# EAGLE design electronicload (EAGLE 6.5.0)
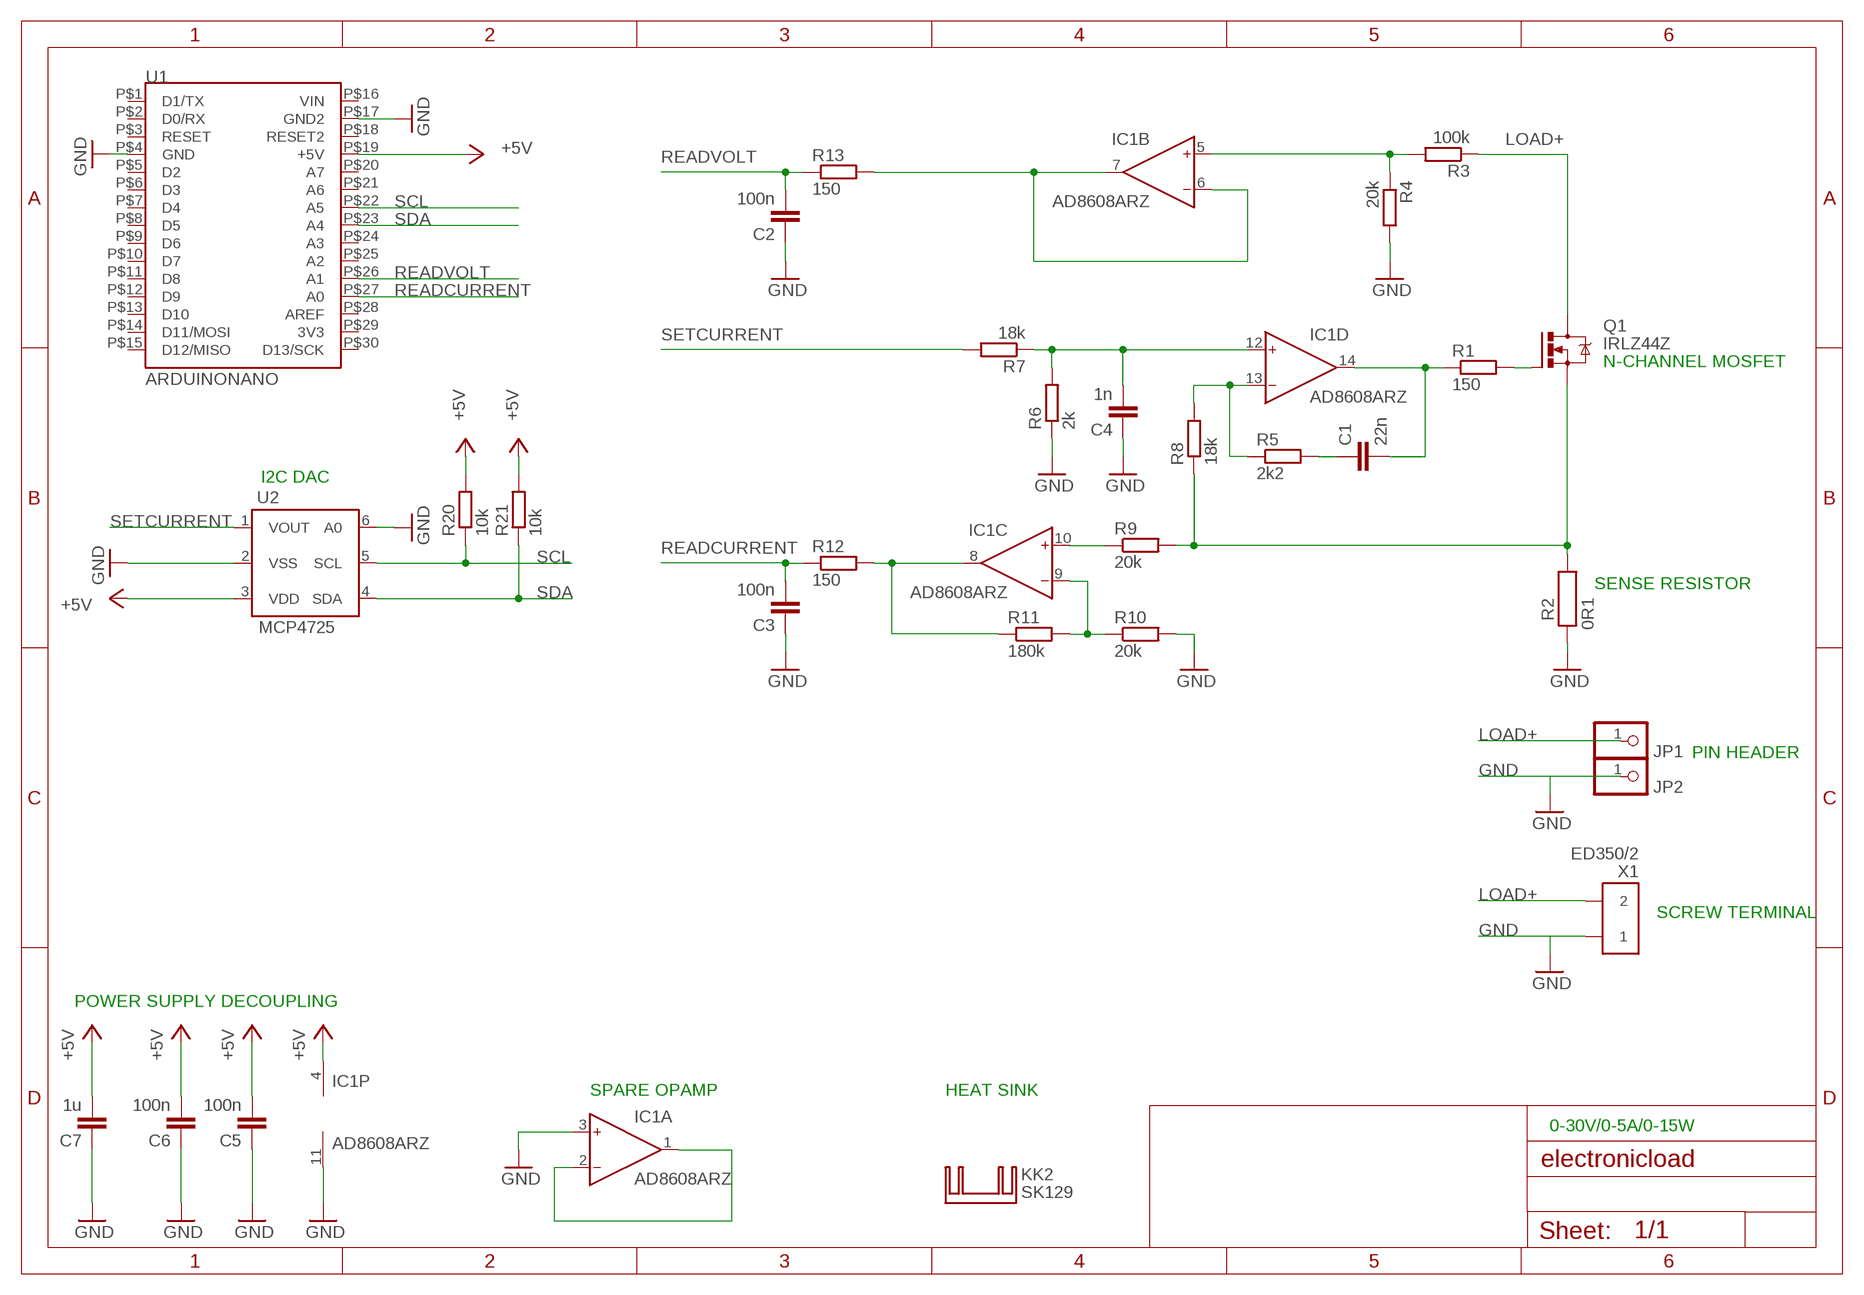
[diagram p0: schematic, sheet 1]

## Parts
C1  22n  C-EUC0603K  [C0603K]
C2  100n  C-EUC0603K  [C0603K]
C3  100n  C-EUC0603K  [C0603K]
C4  1n  C-EUC0603K  [C0603K]
C5  100n  C-EUC0603K  [C0603K]
C6  100n  C-EUC0603K  [C0603K]
C7  1u  C-EUC0603K  [C0603K]
IC1  AD8608ARZ  AD8608R  [SO14]
JP1  PINHD-1X1  [1X01]
JP2  PINHD-1X1  [1X01]
KK2  SK129  [SK129-HOLE]
Q1  IRLZ44Z  [TO220BV]
R1  150  R-EU_R0603  [R0603]
R2  0R1  [S3]
R3  100k  R-EU_R0603  [R0603]
R4  20k  R-EU_R0603  [R0603]
R5  2k2  R-EU_R0603  [R0603]
R6  2k  R-EU_R0603  [R0603]
R7  18k  R-EU_R0603  [R0603]
R8  18k  R-EU_R0603  [R0603]
R9  20k  R-EU_R0603  [R0603]
R10  20k  R-EU_R0603  [R0603]
R11  180k  R-EU_R0603  [R0603]
R12  150  R-EU_R0603  [R0603]
R13  150  R-EU_R0603  [R0603]
R20  10k  R-EU_R0603  [R0603]
R21  10k  R-EU_R0603  [R0603]
U1  ARDUINONANO  [ARDUINONANO]
U2  MCP4725  [SOT-23-6]
X1  ED350/2  [ED350/2]

## Nets
+5V: C5.2 C6.2 C7.2 IC1.4(P:V+) R20.2 R21.2 U1.P$19(+5V) U2.3(VDD)
GATE: Q1.G R1.2
GND: C2.1 C3.1 C4.1 C5.1 C6.1 C7.1 IC1.3(A:IN+) IC1.11(P:V-) JP2.1 R2.1 R4.2 R6.1 R10.2 U1.P$4(GND) U1.P$17(GND2) U2.2(VSS) U2.6(A0) X1.P$1
LOAD+: JP1.1 Q1.D R3.1 X1.P$2
N$1: C1.2 IC1.14(D:OUT) R1.1
N$2: IC1.6(B:IN-) IC1.7(B:OUT) R13.2
N$3: IC1.10(C:IN+) R9.1
N$4: IC1.13(D:IN-) R5.1 R8.2
N$5: IC1.5(B:IN+) R3.2 R4.1
N$6: C4.2 IC1.12(D:IN+) R6.2 R7.1
N$7: IC1.9(C:IN-) R10.1 R11.2
N$9: IC1.8(C:OUT) R11.1 R12.2
N$12: C1.1 R5.2
N$20: IC1.1(A:OUT) IC1.2(A:IN-)
READCURRENT: C3.2 R12.1 U1.P$27(A0)
READVOLT: C2.2 R13.1 U1.P$26(A1)
SCL: R20.1 U1.P$22(A5) U2.5(SCL)
SDA: R21.1 U1.P$23(A4) U2.4(SDA)
SENSE: Q1.S R2.2 R8.1 R9.2
SETCURRENT: R7.2 U2.1(VOUT)
Unconnected: U1.P$1(D1/TX) U1.P$2(D0/RX) U1.P$3(RESET) U1.P$5(D2) U1.P$6(D3) U1.P$7(D4) U1.P$8(D5) U1.P$9(D6) U1.P$10(D7) U1.P$11(D8) U1.P$12(D9) U1.P$13(D10) U1.P$14(D11/MOSI) U1.P$15(D12/MISO) U1.P$16(VIN) U1.P$18(RESET2) U1.P$20(A7) U1.P$21(A6) U1.P$24(A3) U1.P$25(A2) U1.P$28(AREF) U1.P$29(3V3) U1.P$30(D13/SCK)

## Notes on the sheet
- N-CHANNEL MOSFET
- I2C DAC
- SENSE RESISTOR
- PIN HEADER
- SCREW TERMINAL
- POWER SUPPLY DECOUPLING
- SPARE OPAMP | HEAT SINK
- 0-30V/0-5A/0-15W

## Library data of the parts
C1 = rcl:C-EU: CAPACITOR, European symbol; DIGIKEY: 445-12490-1-ND; TEMPCOEFF: X5R; TOLERANCE: 10%; VOLTAGE: 25V
C2 C3 C5 C6 = rcl:C-EU: CAPACITOR, European symbol; DIGIKEY: 445-7456-1-ND; TEMPCOEFF: X5R; TOLERANCE: 10%; VOLTAGE: 50V
C4 = rcl:C-EU: CAPACITOR, European symbol; DIGIKEY: 445-12511-1-ND; TEMPCOEFF: X5R; TOLERANCE: 10%; VOLTAGE: 50V
C7 = rcl:C-EU: CAPACITOR, European symbol; DIGIKEY: 311-1444-1-ND; TEMPCOEFF: X5R; TOLERANCE: 10%; VOLTAGE: 16V
IC1 = electronicload:AD8608: Precision, Low Noise, CMOS, Rail-to-Rail, Input/Output Operational Amplifiers http://www.analog.com/static/imported-files/data_sheets/AD8605_8606_8608.pdf; DIGIKEY: AD8608ARZ-ND
JP1 JP2 = pinhead:PINHD-1X1: PIN HEADER
KK2 = heatsink:SK129: HEATSINK manufacturer Fischer/distributor Buerklin
Q1 = electronicload:IRLZ44Z: N-Channel HEXFET® Power MOSFET Logic Level AUTOMOTIVE MOSFET Source: http://www.irf.com/product-info/datasheets/data/irlz44zpbf.pdf; DIGIKEY: IRLZ44ZPBF-ND
R1 R12 R13 = rcl:R-EU_: RESISTOR, European symbol; DIGIKEY: RMCF0603JT150RCT-ND
R2 = electronicload:0R1: S3-0R1F1 Datasheet http://riedon.com/media/pdf/SSL.pdf; DIGIKEY: 696-1214-1-ND
R3 = rcl:R-EU_: RESISTOR, European symbol; DIGIKEY: RMCF0603JT100KCT-ND
R4 R9 R10 = rcl:R-EU_: RESISTOR, European symbol; DIGIKEY: RMCF0603JT20K0CT-ND
R5 = rcl:R-EU_: RESISTOR, European symbol; DIGIKEY: RMCF0603JT2K20CT-ND
R6 = rcl:R-EU_: RESISTOR, European symbol; DIGIKEY: RMCF0603JT2K00CT-ND
R7 R8 = rcl:R-EU_: RESISTOR, European symbol; DIGIKEY: RMCF0603JT18K0CT-ND
R11 = rcl:R-EU_: RESISTOR, European symbol; DIGIKEY: RMCF0603JT180KCT-ND
R20 R21 = rcl:R-EU_: RESISTOR, European symbol; DIGIKEY: RMCF0603JT10K0CT-ND
U1 = electronicload:ARDUINONANO; DIGIKEY: 1050-1001-ND
U2 = electronicload:MCP4725: 12-Bit Digital-to-Analog Converter with EEPROM Memory in SOT-23-6 Datasheet http://ww1.microchip.com/downloads/en/DeviceDoc/22039d.pdf; DIGIKEY: MCP4725A1T-E/CHCT-ND
X1 = electronicload:ED350/2: ED350/X (5.0 mm) TERMINAL BLOCK 5MM VERT 2POS PCB Datasheet http://www.on-shore.com/sites/default/files/manuals/edz350.pdf; DIGIKEY: ED1930-ND

## Board
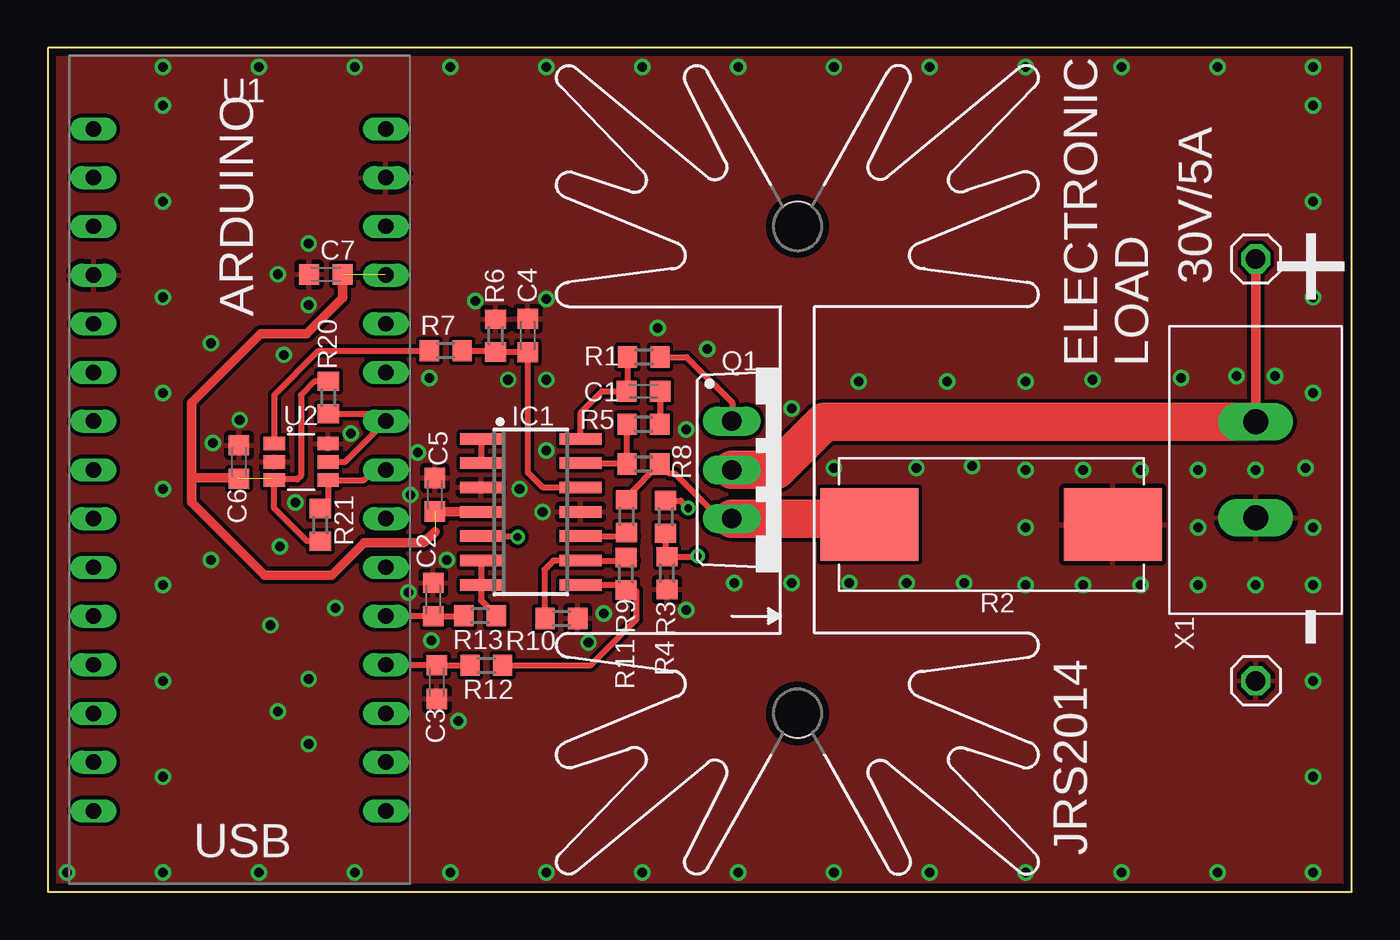
[diagram p1: board, top side]
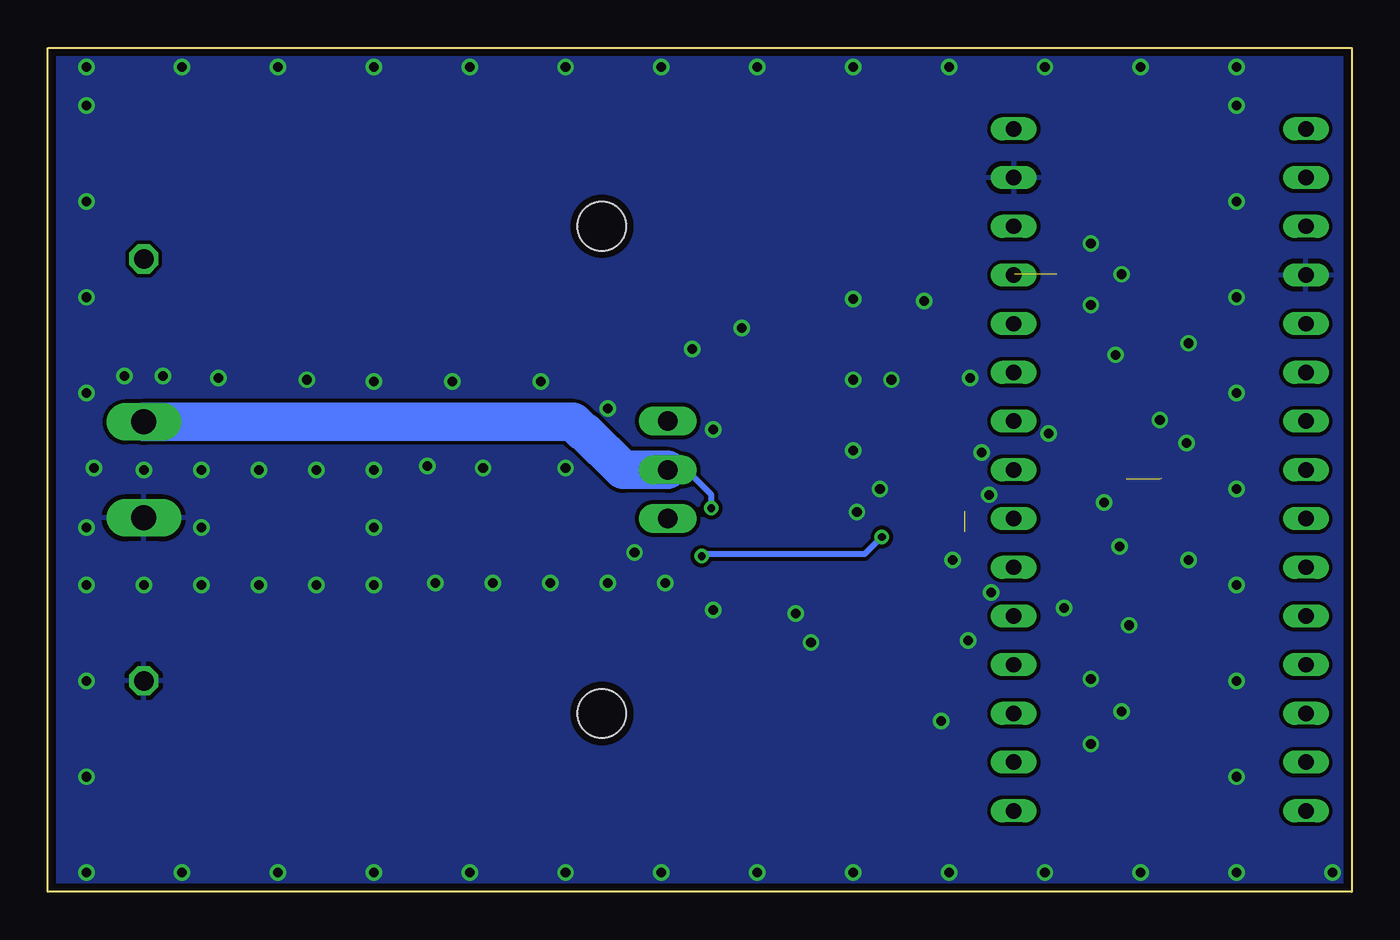
[diagram p2: board, bottom side, seen from below]

Size 68 x 44 mm. Coordinates in mm from the lower left corner, seen from the top.
Outline: 68,0 68,44 0,44 0,0 68,0
Copper layers (1*16): Top 0.0356mm / dielectric 1.5011mm / Bottom 0.0356mm
Design rules "LaenPCBOrder": minimum track width 6mil, minimum drill 13mil, track to track 6mil, track to pad 6mil, pad to pad 6mil, via to via 6mil, smd to smd 6mil, copper to edge 15mil, drill to drill 6mil, minimum pad ring 7mil, minimum via ring 7mil, stop-mask expansion 3mil, vias tented up to drill 0mil, thermal gap 10mil

### Footprints (pad centres in the part's own frame; a part is rotated, then mirrored left to right if it is on the bottom)
C0603K = smd 1.05 x 1.08: 1 -0.875,0; 2 0.875,0
SO14 = smd 0.6 x 2.2: 1 -3.81,-2.6; 2 -2.54,-2.6; 3 -1.27,-2.6; 4 0,-2.6; 5 1.27,-2.6; 6 2.54,-2.6; 7 3.81,-2.6; 8 3.81,2.6; 9 2.54,2.6; 10 1.27,2.6; 11 0,2.6; 12 -1.27,2.6; 13 -2.54,2.6; 14 -3.81,2.6
1X01 = drill 1.016 octagon: 1 0,0
SK129-HOLE = hole 2.54: -12.7,-0.889; 12.7,-0.889
TO220BV = drill 1.016 long: D 0,-2.54; G -2.54,-2.54; S 2.54,-2.54
R0603 = smd 1 x 1.1: 1 -0.85,0; 2 0.85,0
S3 = smd 5.1 x 3.8: 1 -6.35,0; 2 6.35,0
ARDUINONANO = drill 0.8 long: P$1 -7.62,17.78; P$2 -7.62,15.24; P$3 -7.62,12.7; P$4 -7.62,10.16; P$5 -7.62,7.62; P$6 -7.62,5.08; P$7 -7.62,2.54; P$8 -7.62,0; P$9 -7.62,-2.54; P$10 -7.62,-5.08; P$11 -7.62,-7.62; P$12 -7.62,-10.16; P$13 -7.62,-12.7; P$14 -7.62,-15.24; P$15 -7.62,-17.78; P$16 7.62,17.78; P$17 7.62,15.24; P$18 7.62,12.7; P$19 7.62,10.16; P$20 7.62,7.62; P$21 7.62,5.08; P$22 7.62,2.54; P$23 7.62,0; P$24 7.62,-2.54; P$25 7.62,-5.08; P$26 7.62,-7.62; P$27 7.62,-10.16; P$28 7.62,-12.7; P$29 7.62,-15.24; P$30 7.62,-17.78
SOT-23-6 = smd 0.7 x 1.1: 1 -0.95,-1.4; 2 0,-1.4; 3 0.95,-1.4; 4 0.95,1.4; 5 0,1.4; 6 -0.95,1.4
ED350/2 = drill 1.3 long: P$1 0,-2.5; P$2 0,2.5

### Placement (x,y rotation side)
C1  31.06,26.1 180 top
C2  20.1,15.24 270 top
C3  20.28,10.93 90 top
C4  25.03,29 270 top
C5  20.18,20.7 270 top
C6  9.97,22.41 270 top
C7  14.49,32.19 0 top
IC1  25.19,19.81 270 top
JP1  63,33 0 top
JP2  63,11 0 top
KK2  38.21,22 90 top
Q1  38.21,22 270 top
R1  31.08,27.88 0 top
R2  49.2,19.15 180 top
R3  32.22,19.55 270 top
R4  32.29,16.62 270 top
R5  31.06,24.38 0 top
R6  23.35,29 270 top
R7  20.75,28.22 180 top
R8  31.06,22.31 180 top
R9  30.18,19.58 90 top
R10  26.78,14.25 0 top
R11  30.15,16.58 90 top
R12  22.87,11.8 0 top
R13  22.54,14.4 0 top
R20  14.63,25.77 90 top
R21  14.21,19.13 270 top
U1  10,22 0 top
U2  13.21,22.42 270 top
X1  63,22 0 top

### Tracks (layer width: path | path; a pad name or v marks a point on that pad's centre or on a via)
+5V  (5 unrouted)
  Top 0.3: 11.75,21.53 U2.3 | 17.59,32.19 U1.P$19 | R20.2 13.92,26.62 13.2,25.9 13.2,21.7 13,21.5 11.85,21.5 U2.3 | R21.2 13.52,18.28 11.8,20 11.8,21.45 U2.3
  Top 0.5: IC1.4 20.2,19.81 | 9.7,21.5 C6.2 9.6,21.6 | C7.2 15.37,30.97 13.5,29.1 11.1,29.1 7.5,25.5 7.5,21.6 | 20.18,18.78 19.6,18.2 16.5,18.2 14.8,16.5 11.3,16.5 7.5,20.3 7.5,21.6 | 7.5,21.6 9.9,21.6
GATE
  Top 0.3: R1.2 33.32,27.88 35.7,25.5 35.7,24.16 Q1.G
GND  (via drill 0.5)
  other vias: 1,1 11,1 16,1 21,1 26,1 31,1 36,1 41,1 46,1 51,1 56,1 61,1 66,1 66,6 66,11 66,26 66,31 66,36 66,41 56,43 51,43 46,43 41,43 36,43 31,43 26,43 21,43 16,43 11,43 6,43 6,11 6,16 6,21 6,26 6,31 6,36 6,41 61,43 63,16 60,16 57,16 54,16 51,16 51,19 51,22 54,22 57,22 60,22 63,22 65.6,22.1 66,19 60,19 29,14.5 28.2,13 33.3,14.7 13.6,7.7 12,9.4 13.6,11.1 13.6,33.8 12,32.2 13.6,30.6 19.3,22.9 18.9,20.7 24.6,21 20.8,17.3 18.8,15.6 15.8,23.9 10,24.6 8.6,23.4 22.3,30.8 26,30.9 25.8,19.8 33.3,24.1 24,26.7 26,26.7 12.9,20.3 12.1,18 12.3,28 21.4,8.9 15,14.8 11.6,13.9 8.5,17.3 8.5,28.6 19.9,26.8 31.8,29.4 38.8,25.2 42.3,26.6 46.9,26.6 51,26.6 54.5,26.7 59.1,26.8 62,26.9 64,26.9 41,22.1 45.3,22.1 48.2,22.2 37.4,17.7 20,13.1 34.4,28.3 26,23 47.8,16.1 44.8,16.1 41.8,16.1 38.8,16.1 35.8,16.1 6,1 6,6 66,43 66,16
  pour Top (isolate 0.2): 0,0 68,0 68,44 0,44
  pour Bottom (isolate 0.2): 0,0 68,0 68,44 0,44
LOAD+  (via drill 0.4)
  Top 0.3: R3.1 33,20.4 v33.4,20
  Top 0.508: JP1.1 X1.P$2
  Top 2: Q1.D 38,22 40.5,24.5 X1.P$2
  Bottom 0.3: v33.4,20 33.4,20.7 34.7,22 Q1.D
  Bottom 2: Q1.D 38,22 40,24 40.1,24 40.6,24.5 X1.P$2
N$1
  Top 0.3: IC1.14 27.79,24.99 28.9,26.1 C1.2 30.23,26.14 R1.1
N$2
  Top 0.3: IC1.6 IC1.7 22.59,15.2 R13.2
N$3
  Top 0.3: IC1.10 30.59,18.54 R9.1
N$4
  Top 0.3: R5.1 R8.2 30.17,22.35 IC1.13
N$5  (via drill 0.4)
  Top 0.3: v33.9,17.5 33.77,17.47 R4.1 32.22,17.53 R3.2 | v24.5,18.5 22.63,18.5 IC1.5
  Bottom 0.3: v24.5,18.5 25.4,17.6 33.8,17.6 v33.9,17.5
N$6
  Top 0.3: R7.1 23.33,28.22 R6.2 25,28.15 C4.2 | 25,28.2 C4.2 | C4.2 25.03,21.87 25.8,21.1 27.77,21.1 IC1.12
N$7
  Top 0.3: R10.1 25.9,14.09 25.9,16.8 26.37,17.27 IC1.9 30.59,17.27 R11.2
N$9
  Top 0.3: R12.2 28.3,11.8 30.7,14.2 30.7,15.69 R11.1 30.48,16 IC1.8
N$12
  Top 0.3: C1.1 31.94,24.4 R5.2
N$20
  Top 0.3: IC1.1 IC1.2
READCURRENT
  Top 0.3: U1.P$27 20.25,11.84 C3.2 R12.1
READVOLT
  Top 0.3: U1.P$26 20.09,14.38 C2.2 21.66,14.37 R13.1
SCL
  Top 0.3: U2.5 15.5,22.42 U1.P$22 17.24,24.92 R20.1
SDA
  Top 0.3: R21.1 14.61,19.99 U2.4 16.47,21.47 17,22 U1.P$23
SENSE
  Top 0.3: R9.2 30.18,20.58 R8.1 32.42,21.8 32.7,21.8 34.9,19.6 35.12,19.6 Q1.S
  Top 2: 43.35,19.05 43.6,19.3 43,19.3 R2.2 42.54,19.46 Q1.S
SETCURRENT
  Top 0.3: U2.1 11.81,25.91 14.1,28.2 19.88,28.2 R7.2 20.08,28.22 20.1,28.2

### Text on the board
tPlace: + | 30V/5A | ARDUINO | ELECTRONIC / LOAD | - | USB | JRS2014